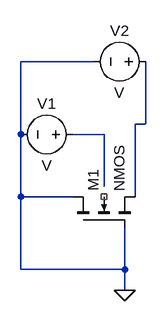
[diagram p0: schematic Draft1.asc]
Draft1.asc, the LTspice schematic file:
Version 4
SHEET 1 880 680
WIRE 144 -928 32 -928
WIRE 224 -832 224 -928
WIRE 224 -832 208 -832
WIRE 32 -816 32 -928
WIRE 160 -816 112 -816
WIRE 160 -736 160 -816
WIRE 32 -720 32 -816
WIRE 112 -720 32 -720
WIRE 208 -720 208 -832
WIRE 32 -608 32 -720
WIRE 192 -608 192 -672
WIRE 192 -608 32 -608
WIRE 192 -576 192 -608
FLAG 192 -576 0
SYMBOL nmos4 112 -672 R270
SYMATTR InstName M1
SYMBOL voltage 128 -816 R90
WINDOW 0 -32 56 VBottom 2
WINDOW 3 32 56 VTop 2
SYMATTR InstName V1
SYMBOL voltage 240 -928 R90
WINDOW 0 -32 56 VBottom 2
WINDOW 3 32 56 VTop 2
SYMATTR InstName V2

The netlist it stands for:
* Draft1.asc
M1 0 0 N001 NC_01 NMOS
V1 N002 0 V
V2 N001 0 V
.model NMOS NMOS
.model PMOS PMOS
.lib standard.mos
.backanno
.end